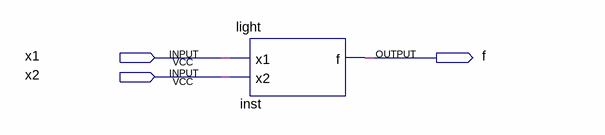
[diagram p0: schematic sheet]
// Quartus schematic Lab1.bdf as structural Verilog: 1 symbols, 3 pins
module Lab1 (
  input  x1,
  input  x2,
  output f
);

  light inst (.x1(x1), .x2(x2), .f(f));
endmodule
